# Altium schematic sheet BBB_Headers.SchDoc: Bernardo
size A3; Date: 14/11/2018; DrawnBy: Wim Van Gool; Revision: 01; SheetNumber: 2; SheetTotal: 7
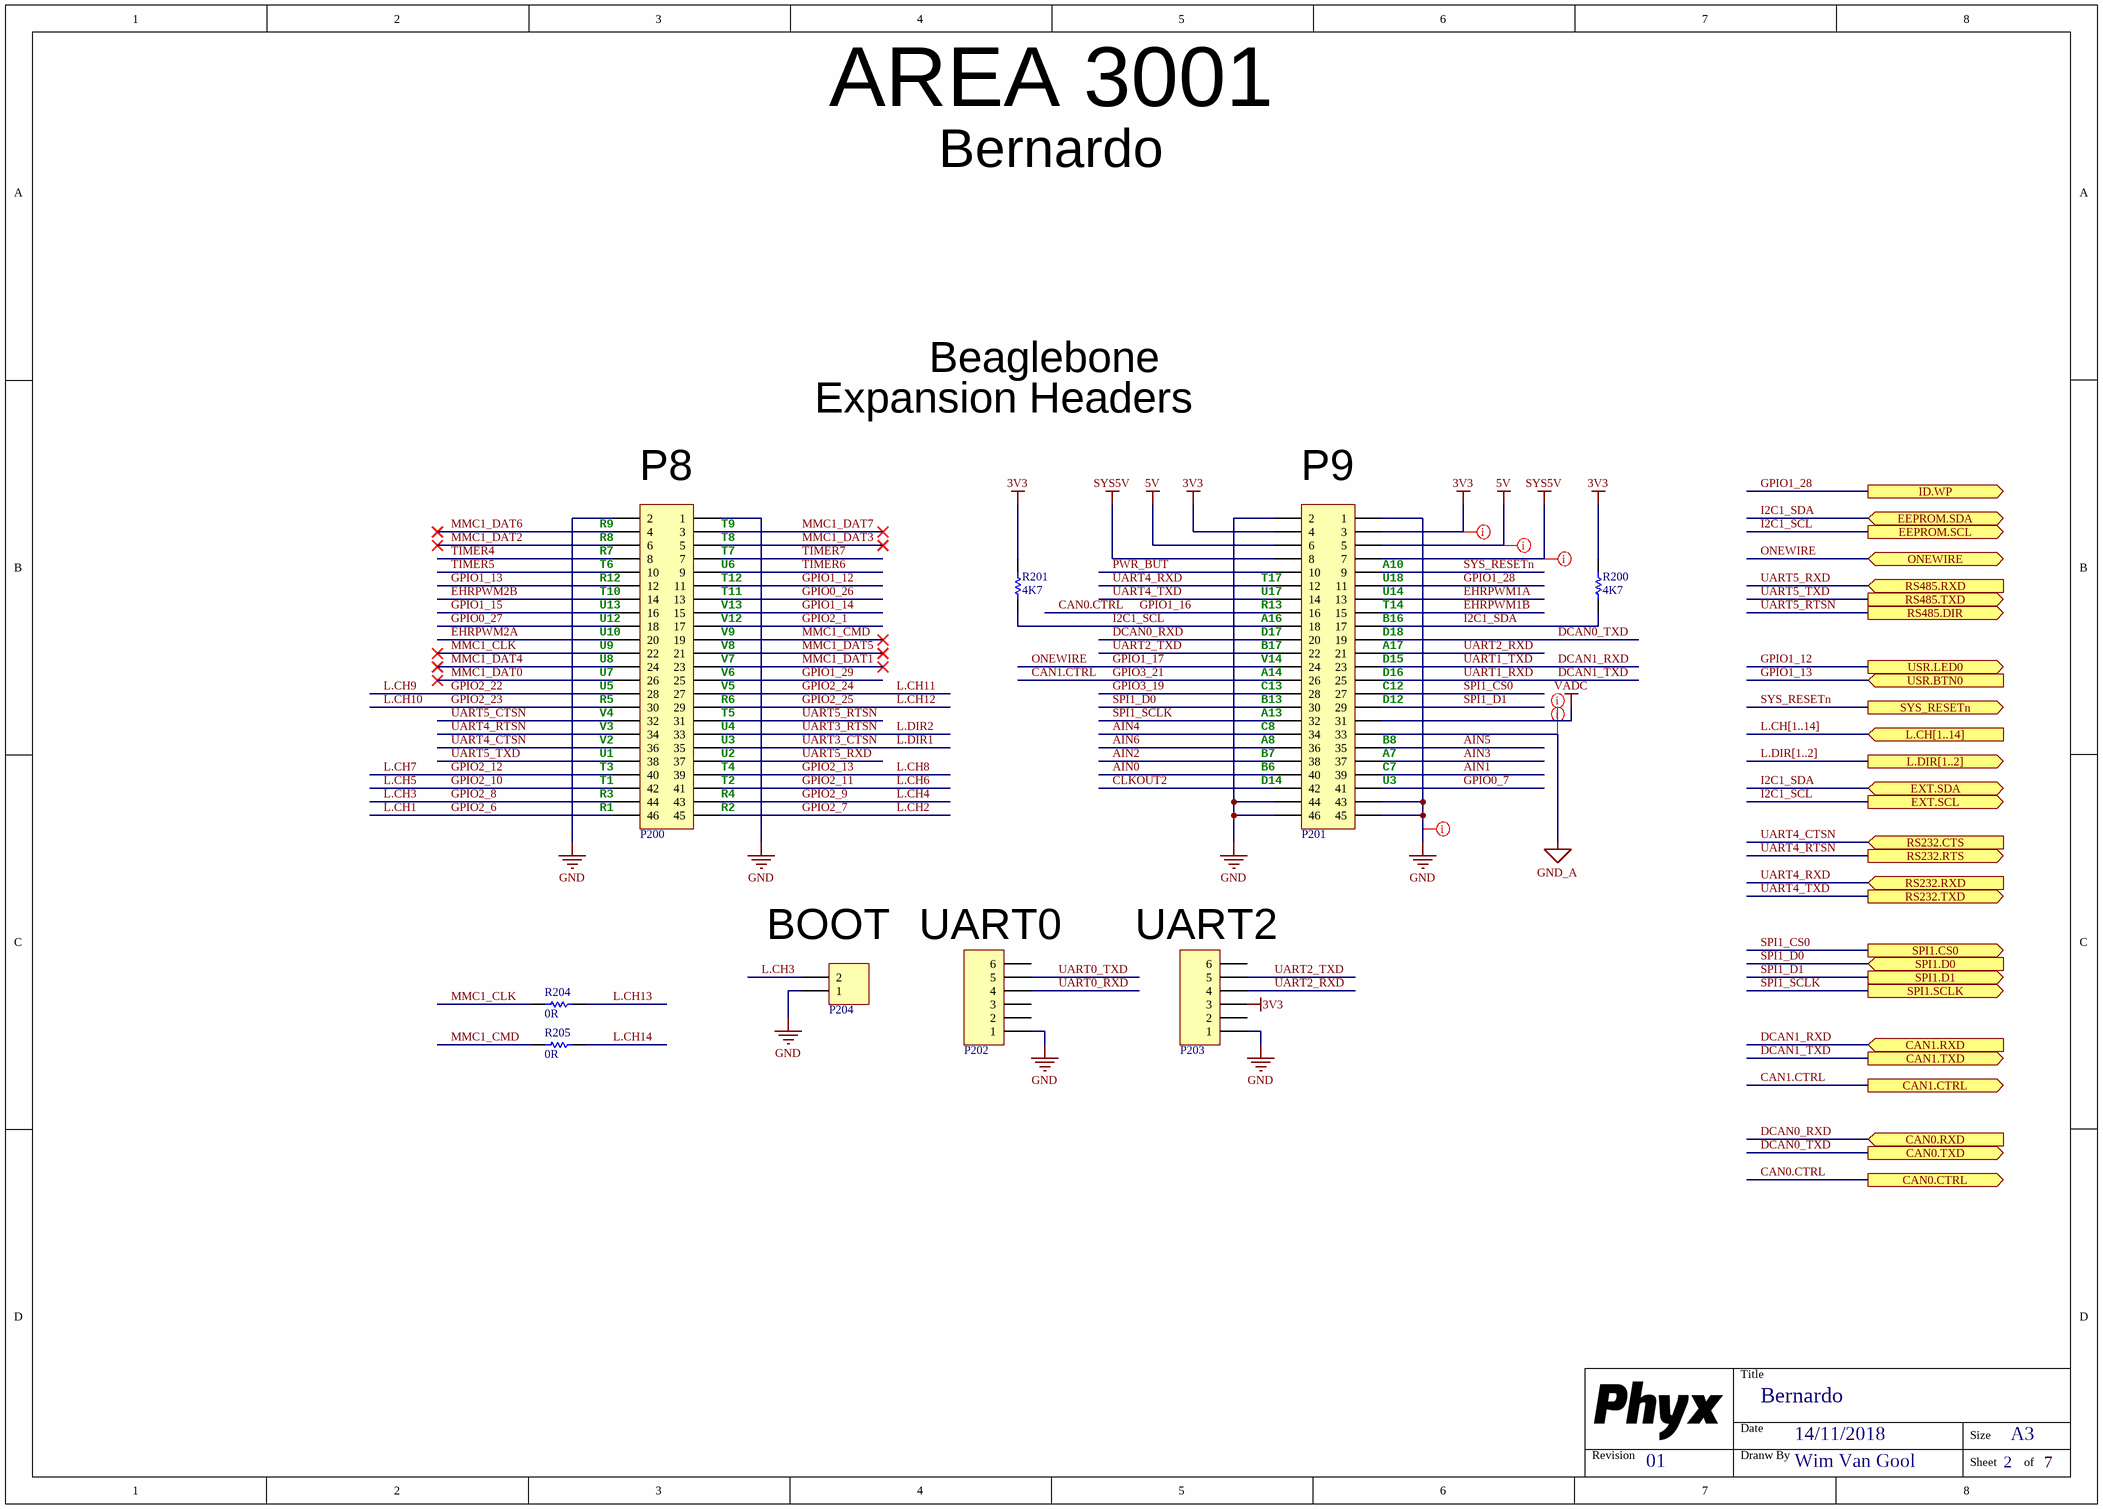
[diagram p0: BBB_Headers.SchDoc]

## Parts
P200  Receptacle 23X2  [HDR2X23]  (value not drawn)
P201  Receptacle 23X2  [HDR2X23]  (value not drawn)
P202  Receptacle 6  [RCPT1X6]  (value not drawn)
P203  Header 6  [HDR1X6]  (value not drawn)
P204  Header 2  [HDR1X2]  (value not drawn)
R200  value 4K7  [R0603_N]  (hidden comment: RESISTOR)
R201  value 4K7  [R0603_N]  (hidden comment: RESISTOR)
R204  value 0R  [R0603_N]  (hidden comment: RESISTOR)
R205  value 0R  [R0603_N]  (hidden comment: RESISTOR)

## Ports
CAN0.CTRL (out), CAN0.RXD (in), CAN0.TXD (out), CAN1.CTRL (out), CAN1.RXD (in), CAN1.TXD (out), EEPROM.SCL (out), EEPROM.SDA (bidir), EXT.SCL (out), EXT.SDA (bidir), ID.WP (out), L.CH[1..14] (in), L.DIR[1..2] (out), ONEWIRE (bidir), RS232.CTS (in), RS232.RTS (out), RS232.RXD (in), RS232.TXD (out), RS485.DIR (out), RS485.RXD (in), RS485.TXD (out), SPI1.CS0 (out), SPI1.D0 (in), SPI1.D1 (out), SPI1.SCLK (out), SYS_RESETn (out), USR.BTN0 (in), USR.LED0 (out)

## Nets
3V3: P201.3 P201.4 P203.3 R200.1 R201.2
5V: P201.5 P201.6
GND: P200.1 P200.2 P201.1 P201.2 P201.43 P201.44 P201.45 P201.46 P202.1 P203.1 P204.1
GND_A: P201.33
SYS5V: P201.7 P201.8
VADC: P201.31
AIN0: P201.40
AIN1: P201.39
AIN2: P201.38
AIN3: P201.37
AIN4: P201.34
AIN5: P201.35
AIN6: P201.36
CAN0.CTRL: P201.16 ; port CAN0.CTRL  [also labelled GPIO1_16]
CAN1.CTRL: P201.26 ; port CAN1.CTRL  [also labelled GPIO3_21]
CLKOUT2: P201.42
DCAN0_RXD: P201.20 ; port CAN0.RXD
DCAN0_TXD: P201.19 ; port CAN0.TXD
DCAN1_RXD: P201.23 ; port CAN1.RXD  [also labelled UART1_TXD]
DCAN1_TXD: P201.25 ; port CAN1.TXD  [also labelled UART1_RXD]
EHRPWM1A: P201.13
EHRPWM1B: P201.15
EHRPWM2A: P200.20
EHRPWM2B: P200.14
GPIO0_7: P201.41
GPIO0_26: P200.13
GPIO0_27: P200.18
GPIO1_12: P200.11 ; port USR.LED0
GPIO1_13: P200.12 ; port USR.BTN0
GPIO1_14: P200.15
GPIO1_15: P200.16
GPIO1_17: P201.24 ; port ONEWIRE  [also labelled ONEWIRE]
GPIO1_28: P201.11 ; port ID.WP
GPIO1_29: P200.25
GPIO2_1: P200.17
GPIO2_6: P200.46  [also labelled L.CH1]
GPIO2_7: P200.45  [also labelled L.CH2]
GPIO2_8: P200.44 P204.2  [also labelled L.CH3]
GPIO2_9: P200.43  [also labelled L.CH4]
GPIO2_10: P200.42  [also labelled L.CH5]
GPIO2_11: P200.41  [also labelled L.CH6]
GPIO2_12: P200.40  [also labelled L.CH7]
GPIO2_13: P200.39  [also labelled L.CH8]
GPIO2_22: P200.28  [also labelled L.CH9]
GPIO2_23: P200.30  [also labelled L.CH10]
GPIO2_24: P200.27  [also labelled L.CH11]
GPIO2_25: P200.29  [also labelled L.CH12]
GPIO3_19: P201.28
I2C1_SCL: P201.18 R201.1 ; port EEPROM.SCL, port EXT.SCL
I2C1_SDA: P201.17 R200.2 ; port EEPROM.SDA, port EXT.SDA
L.CH13: R204.1
L.CH14: R205.1
L.DIR1: P200.35  [also labelled UART3_CTSN]
L.DIR2: P200.33  [also labelled UART3_RTSN]
MMC1_CLK: P200.22 R204.2
MMC1_CMD: P200.19 R205.2
MMC1_DAT0: P200.26
MMC1_DAT1: P200.23
MMC1_DAT2: P200.6
MMC1_DAT3: P200.5
MMC1_DAT4: P200.24
MMC1_DAT5: P200.21
MMC1_DAT6: P200.4
MMC1_DAT7: P200.3
PWR_BUT: P201.10
SPI1_CS0: P201.27 ; port SPI1.CS0
SPI1_D0: P201.30 ; port SPI1.D0
SPI1_D1: P201.29 ; port SPI1.D1
SPI1_SCLK: P201.32 ; port SPI1.SCLK
SYS_RESETn: P201.9 ; port SYS_RESETn
TIMER4: P200.8
TIMER5: P200.10
TIMER6: P200.9
TIMER7: P200.7
UART0_RXD: P202.4
UART0_TXD: P202.5
UART2_RXD: P201.21 P203.4
UART2_TXD: P201.22 P203.5
UART4_CTSN: P200.36 ; port RS232.CTS
UART4_RTSN: P200.34 ; port RS232.RTS
UART4_RXD: P201.12 ; port RS232.RXD
UART4_TXD: P201.14 ; port RS232.TXD
UART5_CTSN: P200.32
UART5_RTSN: P200.31 ; port RS485.DIR
UART5_RXD: P200.37 ; port RS485.RXD
UART5_TXD: P200.38 ; port RS485.TXD

Not connected (* = marked no-connect by the designer): P202 2 3 6; P203 2 6

## Buses and harness runs
bus L.CH[1..14] = port L.CH[1..14]
bus L.DIR[1..2] = port L.DIR[1..2]

## Layout directives
net class POWER: 3V3, 5V, GND, GND_A, SYS5V, VADC

## Notes on the sheet
- AREA 3001
- Bernardo
- Beaglebone
- Expansion Headers
- (near P200) P8
- (near P201) P9
- (near P200) R9
- (near P200) R8
- (near P200) R7
- (near P200) T6
- (near P200) R12
- (near P200) T9
- (near P200) T8
- (near P200) T7
- (near P200) U6
- (near P200) T12
- (near P201) T17
- (near P201) A10
- (near P201) U18
- (near P200) T10
- (near P200) U13
- (near P200) U12
- (near P200) U10
- (near P200) U9
- (near P200) T11
- (near P200) V13
- (near P200) V12
- (near P200) V9
- (near P200) V8
- (near P201) U17
- (near P201) R13
- (near P201) A16
- (near P201) D17
- (near P201) B17
- (near P201) U14
- (near P201) T14
- (near P201) B16
- (near P201) D18
- (near P201) A17
- (near P200) U8
- (near P200) U7
- (near P200) U5
- (near P200) R5
- (near P200) V4
- (near P200) V7
- (near P200) V6
- (near P200) V5
- (near P200) R6
- (near P200) T5
- (near P201) V14
- (near P201) A14
- (near P201) C13
- (near P201) B13
- (near P201) A13
- (near P201) D15
- (near P201) D16
- (near P201) C12
- (near P201) D12
- (near P200) V3
- (near P200) V2
- (near P200) U1
- (near P200) T3
- (near P200) T1
- (near P200) U4
- (near P200) U3
- (near P200) U2
- (near P200) T4
- (near P200) T2
- (near P201) C8
- (near P201) A8
- (near P201) B7
- (near P201) B6
- (near P201) D14
- (near P201) B8
- (near P201) A7
- (near P201) C7
- (near P201) U3
- (near P200) R3
- (near P200) R1
- (near P200) R4
- (near P200) R2
- (near P204) BOOT
- (near P202) UART0
- (near P203) UART2
- Title
- Revision
- Date
- Dranw By
- Size
- A3
- Sheet
- of

## Library data of the parts
P200 P201 = Pin Header 2.54mm dual row 46way: =Description
P202 = Receptacle 2.54mm 6way
P203 = Pin Header 2.54mm 6way
P204 = Pin Header 2.54mm 2way
R200 R201 = RES # 4K7 0603
R204 R205 = RES # 0R 0603: Supplier 1: Farnell; Supplier Part Number 1: 2447743